# Altium project Mixed Signal Board.PrjPcb
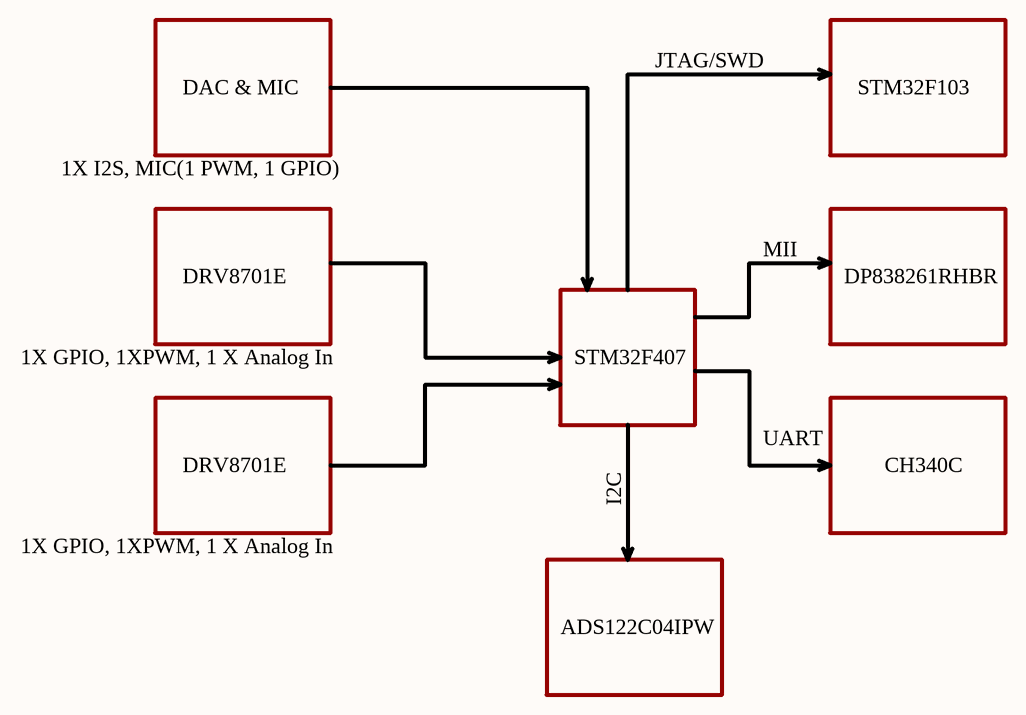
[diagram p0: [1] - Schematic Blocks.SchDoc]
3 sheets, 16 parts. Net scope: flat (ports and power ports of the same name join across sheets).
Sheets:
  [1] - Schematic Blocks.SchDoc
  [2] - Power Budget.SchDoc
  [3] - STM32F103 Debugger.SchDoc

## Sheet [1] - Schematic Blocks.SchDoc
size A4; SheetNumber: 1; SheetTotal: 1

### Notes on the sheet
- DAC & MIC
- JTAG/SWD
- STM32F103
- 1X I2S, MIC(1 PWM, 1 GPIO)
- DRV8701E
- MII
- DP838261RHBR
- 1X GPIO, 1XPWM, 1 X Analog In
- STM32F407
- I2C
- UART
- CH340C
- ADS122C04IPW

## Sheet [2] - Power Budget.SchDoc
size A4; SheetNumber: 2; SheetTotal: 3
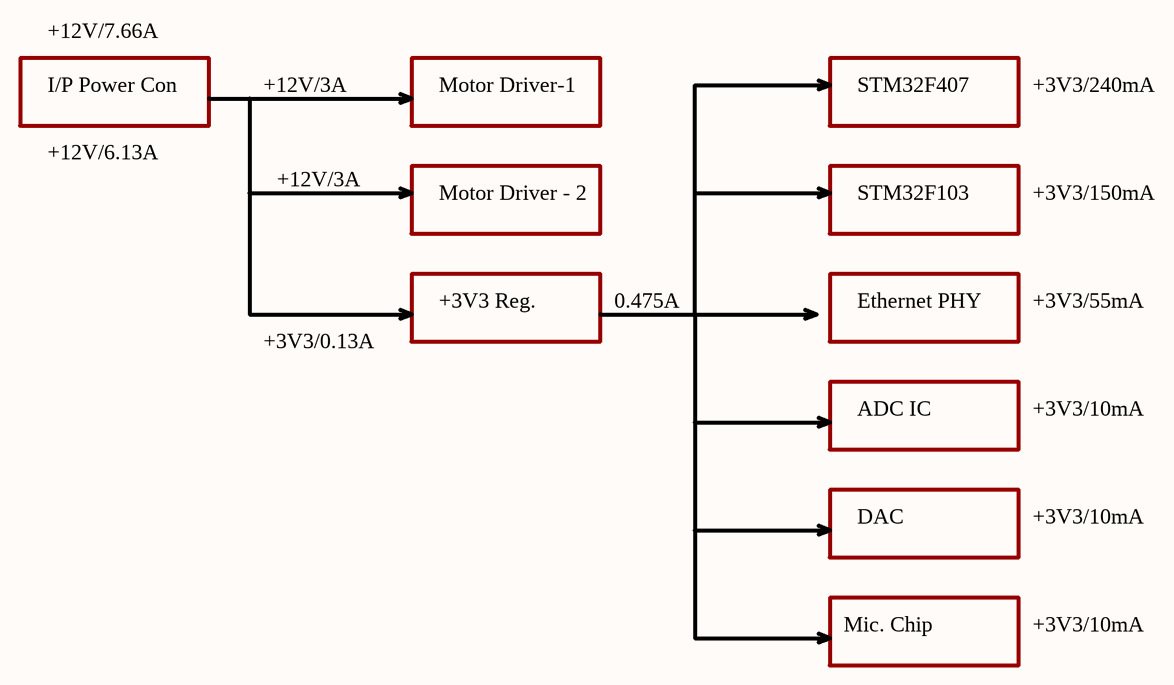
[diagram p1: [2] - Power Budget.SchDoc]

### Notes on the sheet
- +12V/7.66A
- I/P Power Con
- +12V/3A
- Motor Driver-1
- STM32F407
- +3V3/240mA
- +12V/6.13A
- Motor Driver - 2
- STM32F103
- +3V3/150mA
- +3V3/0.13A
- +3V3 Reg.
- 0.475A
- Ethernet PHY
- +3V3/55mA
- ADC IC
- +3V3/10mA
- DAC
- Mic. Chip

## Sheet [3] - STM32F103 Debugger.SchDoc
size A4; SheetNumber: 3; SheetTotal: 3
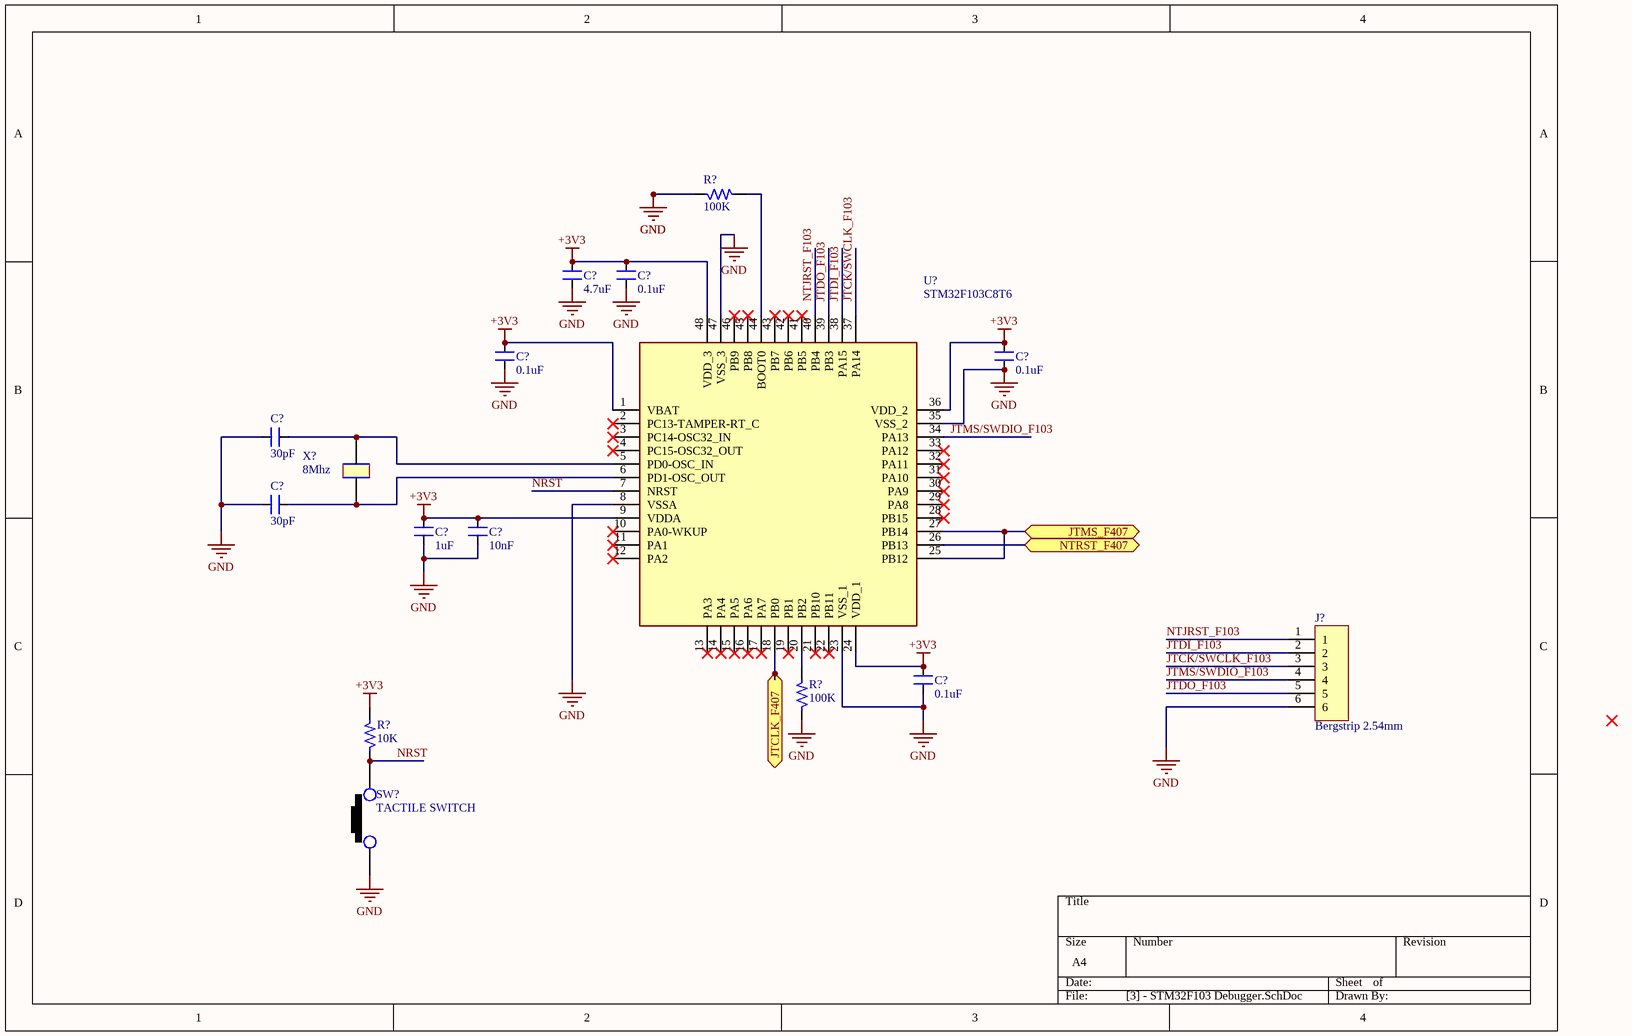
[diagram p2: [3] - STM32F103 Debugger.SchDoc]

### Parts
(Parts that share a designator on the sheet are numbered #1, #2 ... from top to bottom, then left to right.)
C?#1  4.7uF  [CAP_0805]
C?#2  0.1uF  [CAP_0805]
C?#3  0.1uF  [CAP_0805]
C?#4  0.1uF  [CAP_0805]
C?#5  30pF  [CAP_0805]
C?#6  30pF  [CAP_0805]
C?#7  1uF  [CAP_0805]
C?#8  10nF  [CAP_0805]
C?#9  0.1uF  [CAP_0805]
J?  Bergstrip 2.54mm  [CON6_100_59D78_TH_ST]
R?#1  100K  [RES_0603]
R?#2  100K  [RES_0603]
R?#3  10K  [RES_0603]
SW?  TACTILE SWITCH  [SW_342_SMD]
U?  STM32F103C8T6  [LQFP-48_19.6_393_58X11_SMD]
X?  8Mhz  [XTAL_314_240X47_SMD]

### Ports
JTCLK_F407 (bidir), JTMS_F407 (bidir), NTRST_F407 (bidir)

### Nets
+3V3: C?#1.2 C?#2.2 C?#3.2 C?#4.2 C?#7.2 C?#8.2 C?#9.2 R?#3.2 U?.1(VBAT) U?.9(VDDA) U?.24(VDD_1) U?.36(VDD_2) U?.48(VDD_3)
GND: C?#1.1 C?#2.1 C?#3.1 C?#4.1 C?#5.1 C?#6.1 C?#7.1 C?#8.1 C?#9.1 J?.6 R?#1.1 R?#2.1 SW?.1 U?.8(VSSA) U?.23(VSS_1) U?.35(VSS_2) U?.47(VSS_3)
JTCK/SWCLK_F103: J?.3 U?.37(PA14)
JTDI_F103: J?.2 U?.38(PA15)
JTDO_F103: J?.5 U?.39(PB3)
JTMS/SWDIO_F103: J?.4 U?.34(PA13)
NRST: R?#3.1 SW?.2 U?.7(NRST)
NTJRST_F103: J?.1 U?.40(PB4)
NetC?#5_2: C?#5.2 U?.5(PD0-OSC_IN) X?.2
NetC?#6_2: C?#6.2 U?.6(PD1-OSC_OUT) X?.1
NetR?#1_2: R?#1.2 U?.44(BOOT0)
NetR?#2_2: R?#2.2 U?.20(PB2)
NetU?_18: U?.18(PB0) ; port JTCLK_F407
NetU?_25: U?.25(PB12) U?.27(PB14) ; port JTMS_F407
NetU?_26: U?.26(PB13) ; port NTRST_F407

Not connected (* = marked no-connect by the designer): U? 2(PC13-TAMPER-RT_C)* 3(PC14-OSC32_IN)* 4(PC15-OSC32_OUT)* 10(PA0-WKUP)* 11(PA1)* 12(PA2)* 13(PA3)* 14(PA4)* 15(PA5)* 16(PA6)* 17(PA7)* 19(PB1)* 21(PB10)* 22(PB11)* 28(PB15)* 29(PA8)* 30(PA9)* 31(PA10)* 32(PA11)* 33(PA12)* 41(PB5)* 42(PB6)* 43(PB7)* 45(PB8)* 46(PB9)*

### Library data of the parts
C?#1 = CAP_4.7uF-50V-10%-0805: 4.7µF ±10% 50V Ceramic Capacitor X5R 0805 (2012 Metric); Manufacturer: Yageo; Manufacturer Part Number: GRM21BR61H475KE51L; Alternate Part Number-1: NA; Case/Package: 0805; Supplier-1: SIRICOM; Supplier Part Number-1: CL21A475KBQNNNE
C?#2-C?#4 = CAP_0.1uF-50V-10%-0805: 0.1µF ±10% 50V Ceramic Capacitor X7R 0805 (2012 Metric); Manufacturer: Samsung; Manufacturer Part Number: CL21B104KBCNNNC; Alternate Part Number-1: NA; Case/Package: 0805; Supplier-1: SIRICOM; Supplier Part Number-1: 0805B104K500CT
C?#5 C?#6 = CAP_30pF-50V-10%-0805: ±10% 50V Ceramic Capacitor C0G, NP0 0805 (2012 Metric); Manufacturer Part Number: C0805C300K5GAC7800; Manufacturer: KEMET; Alternate Part Number: NA; Case/Package: 0805; Supplier-1: Digikey; Supplier Part Number-1: 399-17443-1-ND - Cut Tape (CT)
C?#7 = CAP_1uF-50V-5%-0805: 1µF ±5% 50V Ceramic Capacitor X7R 0805 (2012 Metric); Manufacturer: Samsung; Manufacturer Part Number: CC0805JKX7R9BB105; Alternate Part Number-1: 0805F105M500NT; Case/Package: 0805; Supplier-1: SIRICOM; Supplier Part Number-1: CL21B105KBFNNNE
C?#8 = CAP_10nF-50V-10%-0805: 10000pF ±10% 50V Ceramic Capacitor X7R 0805 (2012 Metric); Manufacturer: Samsung; Manufacturer Part Number: C0805C103K5RECAUTO; Alternate Part Number-1: GRM2195C1H103JA01D; Case/Package: 0805; Supplier-1: SIRICOM; Supplier Part Number-1: 0805B103K500CT
C?#9 = CAP_0.1uF-50V-5%-0805: 0.1µF ±5% 50V Ceramic Capacitor X7R 0805 (2012 Metric); Manufacturer: AVX Corporation; Manufacturer Part Number: 08055C104JAT4A; Alternate Part Number-1: 0805B104M500; Case/Package: 0805; Supplier-1: SIRICOM; Supplier Part Number-1: 0805B104J500CT
J? = CON-BS-SKT_6X1-100-ST-TH: 6 Pins, 1 Row 2.54mm Pitch, Straight bergstrip, Female; Manufacturer: Molex; Alternate Part Number-1: NA; Manufacturer Part Number: 22-10-2061; Case/Package: TH-CON; Supplier-1: SP ROAD; Supplier Part Number-1: NA
R?#1 R?#2 = RES_100K-0.1W-1%-0603: 100 kOhms ±1% 0.1W, 1/10W Chip Resistor 0603 (1608 Metric) Automotive AEC-Q200 Thick Film; Manufacturer: Stackpole Electronics; Manufacturer Part Number: RMCF0603FT100K; Alternate Part Number-1: NA; Case/Package: 0603; Supplier-1: Arrow; Supplier Part Number-1: RMCF0603FT100K
R?#3 = RES_10K-0.1W-1%-0603: 10 kOhms ±1% 0.1W, 1/10W Chip Resistor 0603 (1608 Metric) Automotive AEC-Q200 Thick Film; Manufacturer: Walsin; Manufacturer Part Number: WR06X1002FTL; Alternate Part Number-1: 0603WAJ0103T5E; Case/Package: 0603; Supplier-1: SIRICOM; Supplier Part Number-1: WR06X1002FTL
SW? = SW1_RS-282G05A3-SMRT-SMD: Tactile Switch SPST-NO Top Actuated Surface Mount; Manufacturer: ITT C&K; Alternate Part Number-1: NA; Manufacturer Part Number: RS-282G05A3-SMRT; Case/Package: SMD; Supplier-1: SP ROAD; Supplier Part Number-1: RS-282G05A3-SMRT
U? = IC_STM32F103C8T6: ARM® Cortex®-M3 STM32F1 Microcontroller IC 32-Bit 72MHz 64KB (64K x 8) FLASH 48-LQFP (7x7); Manufacturer: STMicroelectronics; Alternate Part Number-1: NA; Manufacturer Part Number: STM32F103C8T6; Case/Package: LQFP48; Supplier-1: LCSC; Supplier Part Number-1: STM32F103C8T6
X? = XTAL_8MHZ-ECS-80-32-5PX-SMD: 8MHz ±30ppm Crystal 32pF 60 Ohms HC-49/US; Manufacturer: Fox Electronics; Manufacturer Part Number: ECS-80-32-5PX-TR; Alternate Part Number-1: NA; Case/Package: SMD/SMT; Supplier-1: SP ROAD; Supplier Part Number-1: ECS-80-32-5PX-TR